# EAGLE design sender (EAGLE 9.6.2)
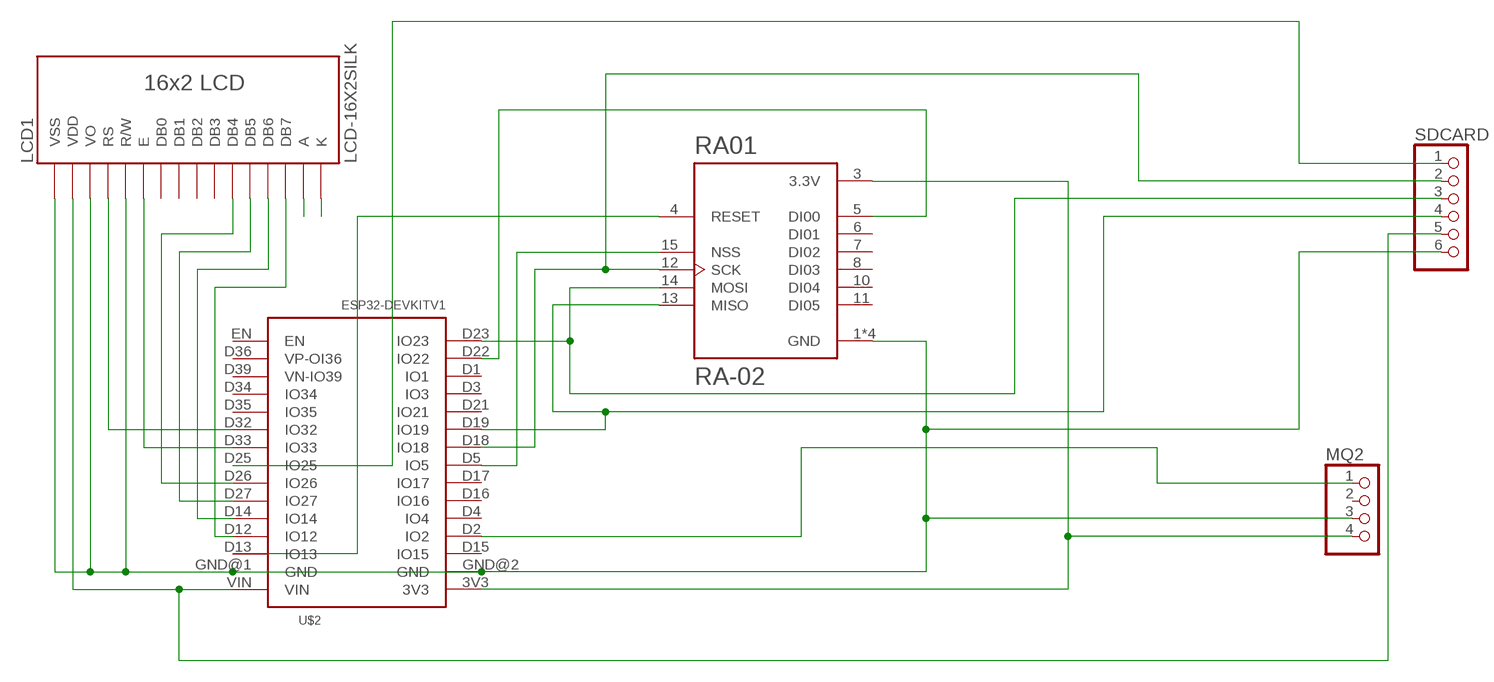
[diagram p0: schematic, sheet 1]

## Parts
LCD1  LCD-16X2SILK  [MODULE_LCD-16X2]
MQ2  PINHD-1X4  [1X04]
RA01  RA-02  [RA-02]
SDCARD  PINHD-1X6  [1X06]
U$2  ESP32DEVKITV1  [ESP32-DEVKITV1]

## Nets
N$17: RA01.4(RESET) U$2.D13(IO13)
N$18: RA01.12(SCK) SDCARD.2 U$2.D18(IO18)
N$19: RA01.15(NSS) U$2.D5(IO5)
N$20: RA01.5(DI00) U$2.D22(IO22)
N$21: RA01.13(MISO) SDCARD.4 U$2.D19(IO19)
N$22: RA01.14(MOSI) SDCARD.3 U$2.D23(IO23)
N$24: MQ2.4 RA01.3(3.3V) U$2.3V3
N$25: LCD1.1(VSS) LCD1.3(VO) LCD1.5(R/W) MQ2.3 RA01.1(GND) RA01.2(GND) RA01.9(GND) RA01.16(GND) SDCARD.6 U$2.GND@1(GND) U$2.GND@2(GND)
N$26: LCD1.14(DB7) U$2.D12(IO12)
N$27: LCD1.13(DB6) U$2.D14(IO14)
N$28: LCD1.12(DB5) U$2.D27(IO27)
N$29: LCD1.11(DB4) U$2.D26(IO26)
N$30: LCD1.2(VDD) SDCARD.5 U$2.VIN
N$31: LCD1.6(E) U$2.D33(IO33)
N$32: LCD1.4(RS) U$2.D32(IO32)
N$33: MQ2.1 U$2.D2(IO2)
N$34: SDCARD.1 U$2.D25(IO25)
N$35: LCD1.15(A)
N$36: LCD1.16(K)
Unconnected: LCD1.7(DB0) LCD1.8(DB1) LCD1.9(DB2) LCD1.10(DB3) MQ2.2 RA01.6(DI01) RA01.7(DI02) RA01.8(DI03) RA01.10(DI04) RA01.11(DI05) U$2.D1(IO1) U$2.D3(IO3) U$2.D4(IO4) U$2.D15(IO15) U$2.D16(IO16) U$2.D17(IO17) U$2.D21(IO21) U$2.D34(IO34) U$2.D35(IO35) U$2.D36(VP-OI36) U$2.D39(VN-IO39) U$2.EN

## Library data of the parts
LCD1 = LCD-16X2:LCD-16X2: Check availability <https://pricing.snapeda.com/parts/LCD-16X2/Gravitech/view-part?ref=eda>; AVAILABILITY: Not in stock; CHECK_PRICES: https://www.snapeda.com/parts/LCD-16X2/Gravitech/view-part/?ref=eda; DESCRIPTION: Display Development Tools 16x2 Black on Green Char LCD w Backlight; MF: Gravitech; MP: LCD-16X2; PACKAGE: None; PRICE: None; SNAPEDA_LINK: https://www.snapeda.com/parts/LCD-16X2/Gravitech/view-part/?ref=snap
MQ2 = pinhead:PINHD-1X4: PIN HEADER
RA01 = RA-02:RA-02: Check availability <https://pricing.snapeda.com/parts/RA-02/Ai-Thinker/view-part?ref=eda>; AVAILABILITY: In Stock; CHECK_PRICES: https://www.snapeda.com/parts/RA-02/AI-Thinker/view-part/?ref=eda; DESCRIPTION: General ISM < 1GHz LoRa™ Transceiver Module 410MHz ~ 525MHz Antenna Not Included, I-PEX Surface Mount; MF: Ai-Thinker; MP: RA-02; PACKAGE: None; PRICE: None; SNAPEDA_LINK: https://www.snapeda.com/parts/RA-02/AI-Thinker/view-part/?ref=snap
SDCARD = pinhead:PINHD-1X6: PIN HEADER
U$2 = ESP32-DEVKITV1:ESP32DEVKITV1

## Board
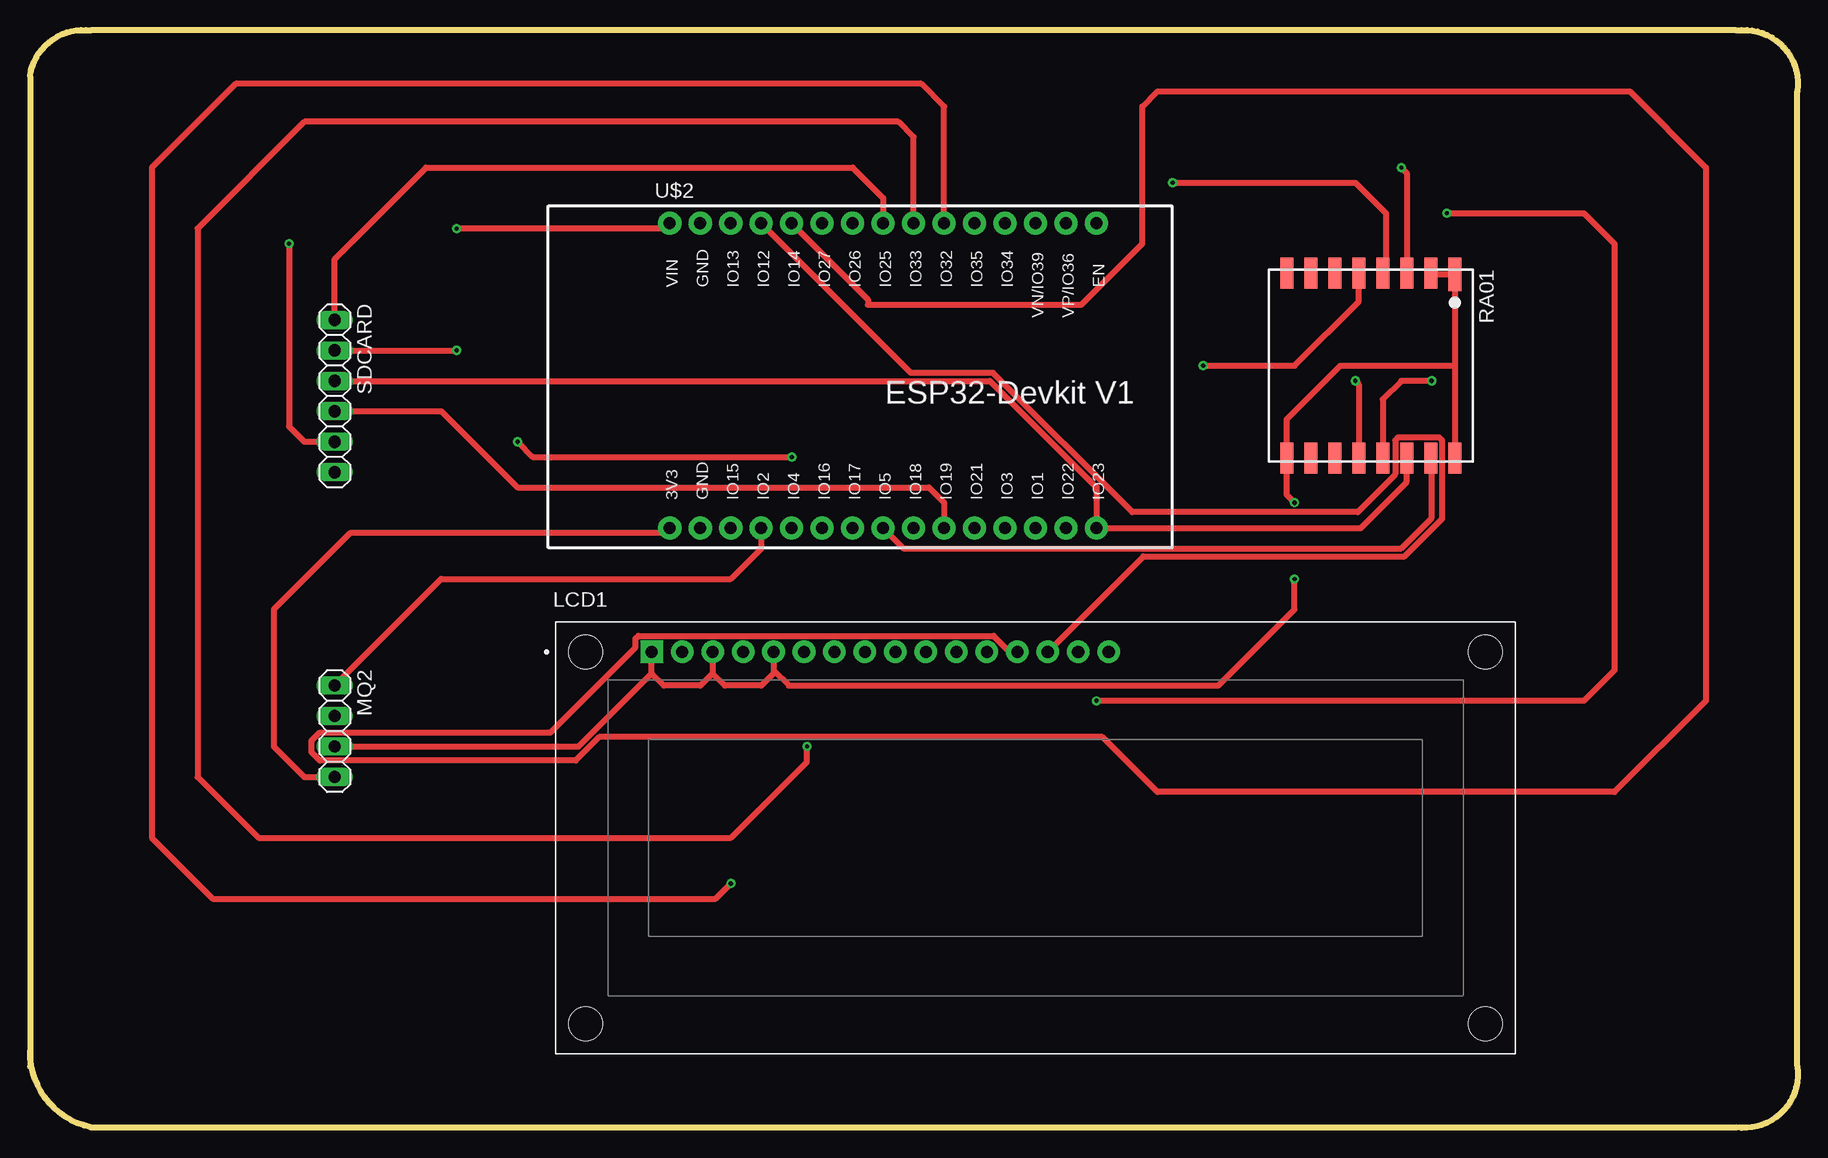
[diagram p1: board, top side]
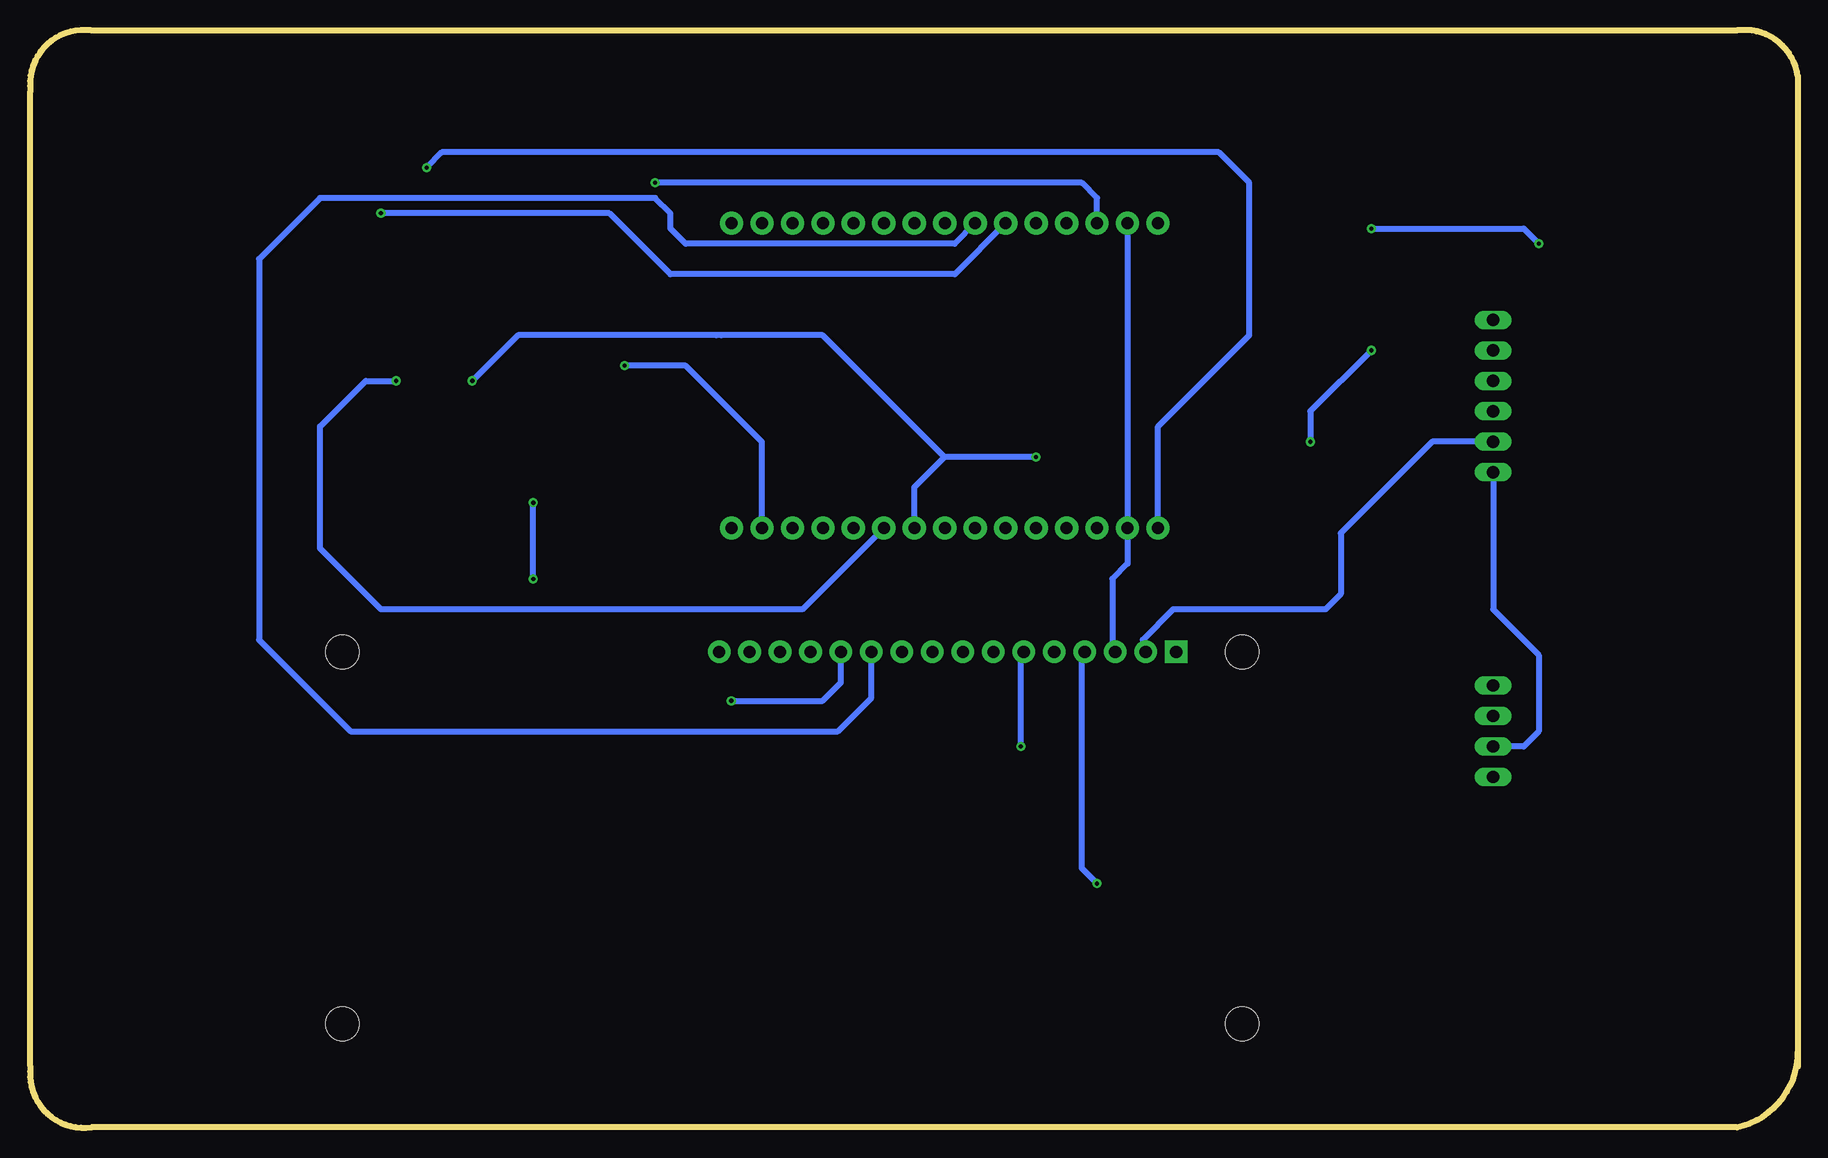
[diagram p2: board, bottom side, seen from below]

Size 147.36 x 91.52 mm. Coordinates in mm from the lower left corner, seen from the top.
Outline: 0,6.39 0,87.67 arc-90 5.08,91.48 142.24,91.48 arc-106 147.32,86.4 147.32,5.12 arc-106 142.24,0.04 5.08,0.04 arc-79 0,6.39
Outline: 0,6.39 0,5.12
Copper layers (1*16): Top 0.035mm / dielectric 1.5mm / Bottom 0.035mm
Design rules "default": minimum track width 6mil, minimum drill 0.35mm, track to track 6mil, track to pad 6mil, pad to pad 6mil, via to via 6mil, smd to smd 6mil, copper to edge 40mil, drill to drill 6mil, minimum pad ring 10mil, minimum via ring 8mil, stop-mask expansion 4mil, vias tented up to drill 0mil, thermal gap 10mil

### Footprints (pad centres in the part's own frame; a part is rotated, then mirrored left to right if it is on the bottom)
MODULE_LCD-16X2 = drill 1.016 pad 1.88 square: 1 -32,15.5 | drill 1.016 pad 1.88: 2 -29.46,15.5; 3 -26.92,15.5; 4 -24.38,15.5; 5 -21.84,15.5; 6 -19.3,15.5; 7 -16.76,15.5; 8 -14.22,15.5; 9 -11.68,15.5; 10 -9.14,15.5; 11 -6.6,15.5; 12 -4.06,15.5; 13 -1.52,15.5; 14 1.02,15.5; 15 3.56,15.5; 16 6.1,15.5 | hole 2.8: -37.5,15.5; -37.5,-15.5; 37.5,15.5; 37.5,-15.5
1X04 = drill 1.016 long: 1 -3.81,0; 2 -1.27,0; 3 1.27,0; 4 3.81,0
RA-02 = smd 2.8 x 1.1: 1 -7.6,7 | smd 2.6 x 1.1: 2 -7.7,5; 3 -7.7,3; 4 -7.7,1; 5 -7.7,-1; 6 -7.7,-3; 7 -7.7,-5; 8 -7.7,-7; 9 7.7,-7; 10 7.7,-5; 11 7.7,-3; 12 7.7,-1; 13 7.7,1; 14 7.7,3; 15 7.7,5; 16 7.7,7
1X06 = drill 1.016 long: 1 -6.35,0; 2 -3.81,0; 3 -1.27,0; 4 1.27,0; 5 3.81,0; 6 6.35,0
ESP32-DEVKITV1 = drill 1 pad 1.93: 3V3 -16.52,-12.27; D1 13.96,-12.27; D2 -8.9,-12.27; D3 11.42,-12.27; D4 -6.36,-12.27; D5 1.26,-12.27; D12 -8.9,13.135; D13 -11.44,13.135; D14 -6.36,13.135; D15 -11.44,-12.27; D16 -3.82,-12.27; D17 -1.28,-12.27; D18 3.8,-12.27; D19 6.34,-12.27; D21 8.88,-12.27; D22 16.5,-12.27; D23 19.04,-12.27; D25 1.26,13.135; D26 -1.28,13.135; D27 -3.82,13.135; D32 6.34,13.135; D33 3.8,13.135; D34 11.42,13.135; D35 8.88,13.135; D36 16.5,13.135; D39 13.96,13.135; EN 19.04,13.135; GND@1 -13.98,13.135; GND@2 -13.98,-12.27; VIN -16.52,13.135

### Placement (x,y rotation side)
LCD1  83.82,24.17 0 top
MQ2  25.4,33.06 270 top
RA01  111.76,63.54 270 top
SDCARD  25.4,61 270 top
U$2  69.85,62.27 0 top

### Tracks (layer width: path | path; a pad name or v marks a point on that pad's centre or on a via)
N$17  (via drill 0.35)
  Top 0.508: RA01.4 113.03,71.51 113.03,76.24 110.49,78.78 v95.25,78.78
  Bottom 0.508: U$2.D13 58.42,75.42 58.42,77.51 59.69,78.78 v95.25,78.78
N$18  (via drill 0.35)
  Top 0.508: SDCARD.2 v35.56,64.81 | v40.64,57.19 41.91,55.92 v63.5,55.92 | v110.49,62.27 110.76,62 RA01.12
  Bottom 0.508: v35.56,64.81 40.64,59.73 v40.64,57.19 | 71.12,55.92 73.66,53.38 U$2.D18 | v63.5,55.92 71.12,55.92 | v110.49,62.27 106.68,66.08 90.17,66.08 89.73,66.08 81.28,66.08 71.12,55.92
N$19
  Top 0.508: U$2.D5 72.81,48.3 114.3,48.3 116.84,50.84 116.84,55.76 RA01.15
N$20  (via drill 0.35)
  Top 0.508: RA01.5 110.76,68.89 105.41,63.54 v97.79,63.54
  Bottom 0.508: U$2.D22 86.35,57.18 92.71,63.54 v97.79,63.54
N$21  (via drill 0.35)
  Top 0.508: SDCARD.4 34.29,59.73 40.64,53.38 74.93,53.38 76.2,52.11 U$2.D19 | v116.84,62.27 114.3,62.27 112.76,60.73 RA01.13
  Bottom 0.508: U$2.D19 82.97,43.22 118.11,43.22 123.19,48.3 123.19,58.46 119.38,62.27 v116.84,62.27
N$22
  Top 0.508: U$2.D23 | U$2.D23 110.92,50 114.76,53.84 RA01.14 | SDCARD.3 80.01,62.27 88.9,53.38 U$2.D23
N$24  (via drill 0.35)
  Top 0.508: U$2.3V3 52.9,49.57 26.67,49.57 20.32,43.22 20.32,31.79 22.86,29.25 MQ2.4 | v114.3,80.05 114.76,79.59 RA01.3
  Bottom 0.508: U$2.3V3 53.33,58.47 45.72,66.08 45.72,78.78 48.26,81.32 113.03,81.32 v114.3,80.05
N$25  (via drill 0.35)
  Top 0.508: RA01.2 116.86,71.14 RA01.1 118.76,63.54 | 118.76,63.54 RA01.16 | MQ2.3 45.72,31.79 51.82,37.89 | 51.82,37.89 LCD1.1 | LCD1.3 56.9,37.89 | 56.9,37.89 55.88,36.87 52.84,36.87 51.82,37.89 | LCD1.5 61.98,38.14 | 61.98,38.14 61.98,37.89 60.96,36.87 57.92,36.87 56.9,37.89 | 61.98,38.14 63.25,36.87 99.06,36.87 105.41,43.22 v105.41,45.76 | v105.41,52.11 104.76,52.76 RA01.9 104.76,59.08 109.22,63.54 118.76,63.54
  Bottom 0.508: SDCARD.6 25.4,43.22 21.59,39.41 21.59,33.06 22.86,31.79 MQ2.3 | U$2.GND@1 U$2.GND@2 55.88,47.03 57.15,45.76 57.15,39.92 LCD1.3 | v105.41,45.76 v105.41,52.11
N$26
  Top 0.508: LCD1.14 92.81,47.64 114.57,47.64 117.72,50.78 117.72,57.31 117.48,57.55 114.04,57.55 113.8,57.31 113.8,54.46 110.67,51.33 91.89,51.33 80.28,62.93 73.42,62.93 U$2.D12
N$27
  Top 0.508: U$2.D14 69.85,69.05 69.85,68.62 87.63,68.62 92.71,73.7 92.71,85.13 93.98,86.4 133.35,86.4 139.7,80.05 139.7,35.6 132.08,27.98 93.99,27.98 89.39,32.58 47.44,32.58 45.49,30.62 24.15,30.62 23.47,31.31 23.47,32.27 24.15,32.96 43.38,32.96 50.47,40.05 50.47,40.78 50.71,41.02 80.32,41.02 81.66,39.67 LCD1.13
N$28  (via drill 0.35)
  Top 0.508: v118.11,76.24 129.54,76.24 132.08,73.7 132.08,38.14 129.54,35.6 v88.9,35.6
  Bottom 0.508: U$2.D27 70.28,71.16 93.98,71.16 99.06,76.24 v118.11,76.24 | v88.9,35.6 81.28,35.6 79.76,37.12 LCD1.12
N$29
  Bottom 0.508: U$2.D26 70.28,73.7 92.71,73.7 93.98,74.97 93.98,76.24 95.25,77.51 123.19,77.51 128.27,72.43 128.27,40.68 120.65,33.06 80.01,33.06 77.22,35.85 LCD1.11
N$30  (via drill 0.35)
  Top 0.508: U$2.VIN 52.89,74.97 v35.56,74.97 | v21.59,73.7 21.59,58.46 22.86,57.19 SDCARD.5
  Bottom 0.508: v35.56,74.97 22.86,74.97 v21.59,73.7 | SDCARD.5 30.48,57.19 38.1,49.57 38.1,44.49 39.37,43.22 52.07,43.22 54.61,40.68 54.61,39.92 LCD1.2
N$31  (via drill 0.35)
  Top 0.508: U$2.D33 73.65,82.6 72.39,83.86 22.86,83.86 13.97,74.97 13.97,29.25 19.05,24.17 58.42,24.17 64.77,30.52 v64.77,31.79
  Bottom 0.508: v64.77,31.79 64.77,39.42 LCD1.6
N$32  (via drill 0.35)
  Top 0.508: U$2.D32 76.19,85.12 76.2,85.13 74.3,87.04 17.14,87.04 10.16,80.05 10.16,24.17 15.24,19.09 57.15,19.09 v58.42,20.36
  Bottom 0.508: v58.42,20.36 59.69,21.63 59.69,39.42 LCD1.4
N$33
  Top 0.508: MQ2.1 34.29,45.76 58.42,45.76 60.96,48.3 U$2.D2
N$34
  Top 0.508: SDCARD.1 25.4,72.43 33.02,80.05 68.58,80.05 71.12,77.51 71.12,75.42 U$2.D25